# Altium schematic sheet schBeagleBone.SchDoc
size A4
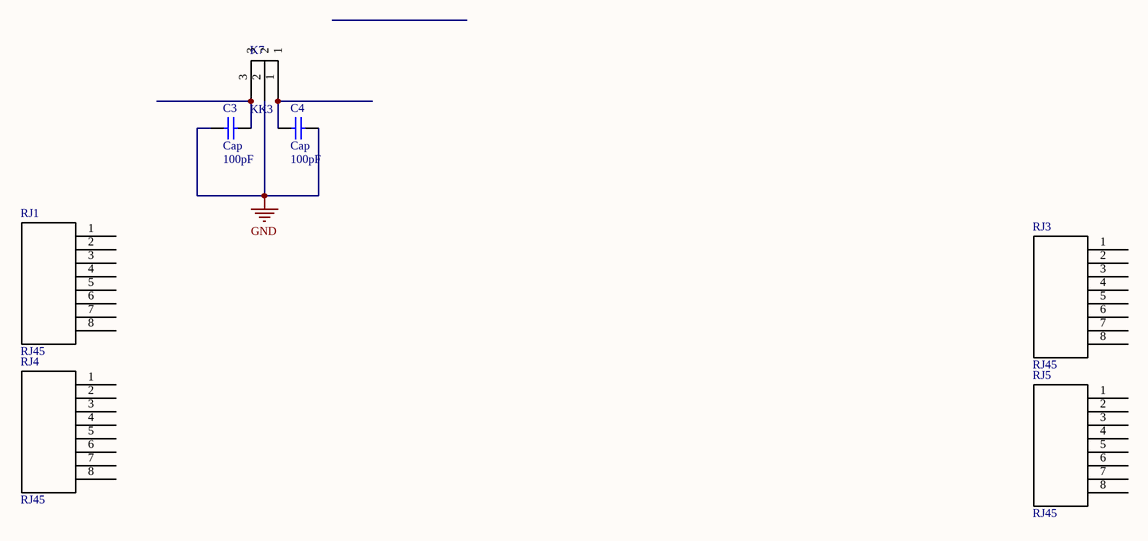
[diagram p0: schBeagleBone.SchDoc]

## Parts
C3  Cap  value 100pF  [RAD-0.3]
C4  Cap  value 100pF  [RAD-0.3]
K7  KK3  [3-vias]
RJ1  RJ45  [RJ45_90]
RJ3  RJ45  [RJ45_Simples]
RJ4  RJ45  [RJ45_90]
RJ5  RJ45  [RJ45_Simples]

## Nets
GND: C3.1 C4.2 K7.2
NetC3_2: C3.2 K7.3
NetC4_1: C4.1 K7.1

Not connected (* = marked no-connect by the designer): RJ1 1(9) 2 3 4 5 6 7 8; RJ3 1(9) 2 3 4 5 6 7 8; RJ4 1(9) 2 3 4 5 6 7 8; RJ5 1(9) 2 3 4 5 6 7 8

## Library data of the parts
C3 C4 = Cap: Capacitor; Published: 8-Jun-2000; LatestRevisionDate: 17-Jul-2002; LatestRevisionNote: Re-released for DXP Platform.; PackageReference: RAD-0.3; Publisher: Altium Limited; PackageDescription: Radial Cap, Thru-Hole; 2 Leads; 0.3 in Pin Spacing
K7 = KK3Vias
RJ1 RJ4 = RJ45_90